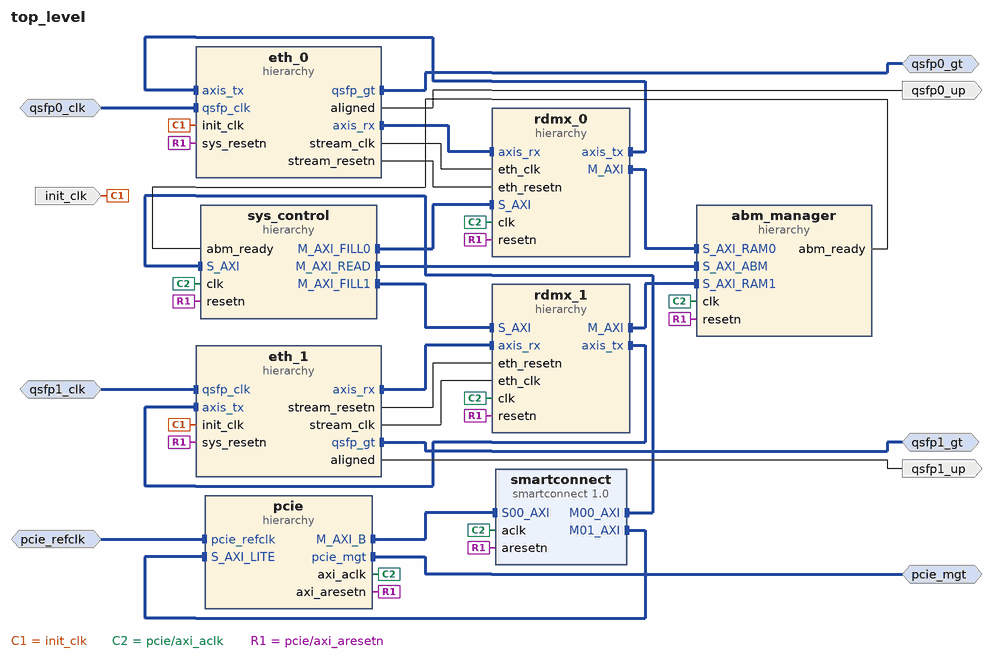
[diagram p0: block diagram of the top level]
# Vivado block design top_level, xcku15p-ffve1517-3-e, Vivado 2021.1
create_bd_design top_level

create_bd_intf_port -mode Slave -vlnv xilinx.com:interface:diff_clock_rtl:1.0 pcie_refclk
create_bd_intf_port -mode Master -vlnv xilinx.com:interface:pcie_7x_mgt_rtl:1.0 pcie_mgt
create_bd_intf_port -mode Slave -vlnv xilinx.com:interface:diff_clock_rtl:1.0 qsfp0_clk
set_property -dict {CONFIG.FREQ_HZ 322265625} [get_bd_intf_ports qsfp0_clk]
create_bd_intf_port -mode Master -vlnv xilinx.com:interface:gt_rtl:1.0 qsfp0_gt
create_bd_intf_port -mode Master -vlnv xilinx.com:interface:gt_rtl:1.0 qsfp1_gt
create_bd_intf_port -mode Slave -vlnv xilinx.com:interface:diff_clock_rtl:1.0 qsfp1_clk
set_property -dict {CONFIG.FREQ_HZ 322265625} [get_bd_intf_ports qsfp1_clk]
create_bd_port -dir O qsfp1_up
create_bd_port -dir O qsfp0_up
create_bd_port -dir I init_clk

create_bd_cell -type hier pcie
create_bd_cell -type hier eth_0
create_bd_cell -type ip -vlnv xilinx.com:ip:smartconnect:1.0 smartconnect
set_property -dict {CONFIG.NUM_CLKS 1 CONFIG.NUM_MI 2 CONFIG.NUM_SI 2} [get_bd_cells smartconnect]
create_bd_cell -type hier eth_1
create_bd_cell -type hier abm_manager
create_bd_cell -type hier sys_control
create_bd_cell -type hier rdmx_0
create_bd_cell -type hier rdmx_1

# ---- hierarchy /pcie ----
current_bd_instance /pcie
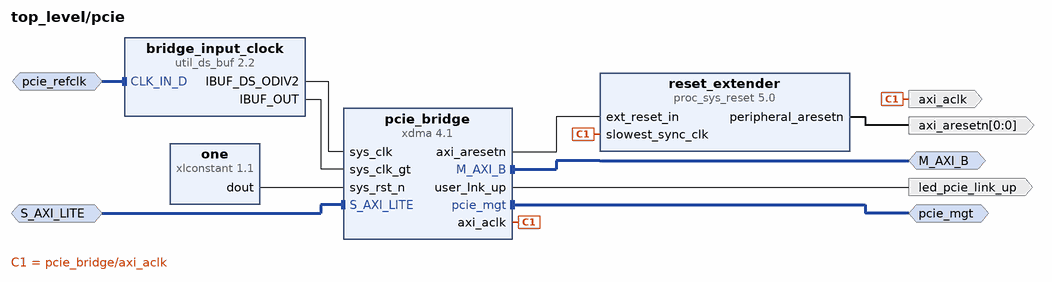
[diagram p1: block diagram inside /pcie]
create_bd_intf_pin -mode Master -vlnv xilinx.com:interface:aximm_rtl:1.0 M_AXI_B
create_bd_intf_pin -mode Slave -vlnv xilinx.com:interface:aximm_rtl:1.0 S_AXI_LITE
create_bd_intf_pin -mode Master -vlnv xilinx.com:interface:pcie_7x_mgt_rtl:1.0 pcie_mgt
create_bd_intf_pin -mode Slave -vlnv xilinx.com:interface:diff_clock_rtl:1.0 pcie_refclk
create_bd_pin -dir O led_pcie_link_up
create_bd_pin -dir O -type clk axi_aclk
create_bd_pin -dir O -from 0 -to 0 -type rst axi_aresetn

create_bd_cell -type ip -vlnv xilinx.com:ip:util_ds_buf:2.2 bridge_input_clock
set_property -dict {CONFIG.C_BUF_TYPE IBUFDSGTE} [get_bd_cells bridge_input_clock]
create_bd_cell -type ip -vlnv xilinx.com:ip:xdma:4.1 pcie_bridge
set_property -dict [list \
  CONFIG.PF0_DEVICE_ID_mqdma 903F \
  CONFIG.PF0_SRIOV_VF_DEVICE_ID A03F \
  CONFIG.PF2_DEVICE_ID_mqdma 923F \
  CONFIG.PF3_DEVICE_ID_mqdma 933F \
  CONFIG.axi_addr_width 64 \
  CONFIG.axi_data_width 512_bit \
  CONFIG.axisten_freq 250 \
  CONFIG.bridge_burst true \
  CONFIG.dma_reset_source_sel User_Reset \
  CONFIG.en_axi_slave_if false \
  CONFIG.enable_jtag_dbg false \
  CONFIG.functional_mode AXI_Bridge \
  CONFIG.mode_selection Advanced \
  CONFIG.pcie_blk_locn X0Y3 \
  CONFIG.pf0_bar0_scale Megabytes \
  CONFIG.pf0_bar0_size 1 \
  CONFIG.pf0_device_id 903F \
  CONFIG.pl_link_cap_max_link_speed 8.0_GT/s \
  CONFIG.pl_link_cap_max_link_width X16 \
  CONFIG.plltype QPLL1 \
] [get_bd_cells pcie_bridge]
create_bd_cell -type ip -vlnv xilinx.com:ip:xlconstant:1.1 one
create_bd_cell -type ip -vlnv xilinx.com:ip:proc_sys_reset:5.0 reset_extender

# ---- hierarchy /eth_0 ----
current_bd_instance /eth_0
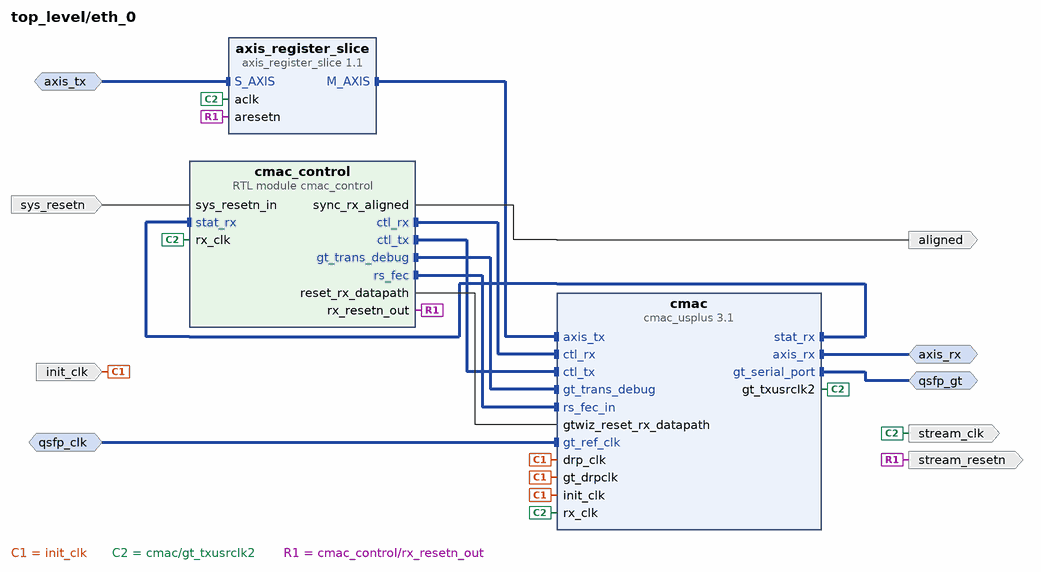
[diagram p2: block diagram inside /eth_0]
create_bd_intf_pin -mode Master -vlnv xilinx.com:interface:gt_rtl:1.0 qsfp_gt
create_bd_intf_pin -mode Slave -vlnv xilinx.com:interface:diff_clock_rtl:1.0 qsfp_clk
create_bd_intf_pin -mode Slave -vlnv xilinx.com:interface:axis_rtl:1.0 axis_tx
create_bd_intf_pin -mode Master -vlnv xilinx.com:interface:axis_rtl:1.0 axis_rx
create_bd_pin -dir I -type rst sys_resetn
create_bd_pin -dir O -type clk stream_clk
create_bd_pin -dir O -type rst stream_resetn
create_bd_pin -dir O aligned
create_bd_pin -dir I init_clk

create_bd_cell -type ip -vlnv xilinx.com:ip:cmac_usplus:3.1 cmac
set_property -dict [list \
  CONFIG.ADD_GT_CNRL_STS_PORTS 1 \
  CONFIG.CMAC_CAUI4_MODE 1 \
  CONFIG.CMAC_CORE_SELECT CMACE4_X0Y0 \
  CONFIG.GT_DRP_CLK 200 \
  CONFIG.GT_GROUP_SELECT {X0Y0~X0Y3} \
  CONFIG.GT_REF_CLK_FREQ 322.265625 \
  CONFIG.INCLUDE_RS_FEC 1 \
  CONFIG.NUM_LANES 4x25 \
  CONFIG.RX_FLOW_CONTROL 0 \
  CONFIG.TX_FLOW_CONTROL 0 \
  CONFIG.USER_INTERFACE AXIS \
] [get_bd_cells cmac]
create_bd_cell -type ip -vlnv xilinx.com:ip:axis_register_slice:1.1 axis_register_slice
create_bd_cell -type module -reference cmac_control cmac_control
set_property -dict {CONFIG.TX_PRECURSOR {"10100"}} [get_bd_cells cmac_control]

# ---- hierarchy /eth_1 ----
current_bd_instance /eth_1
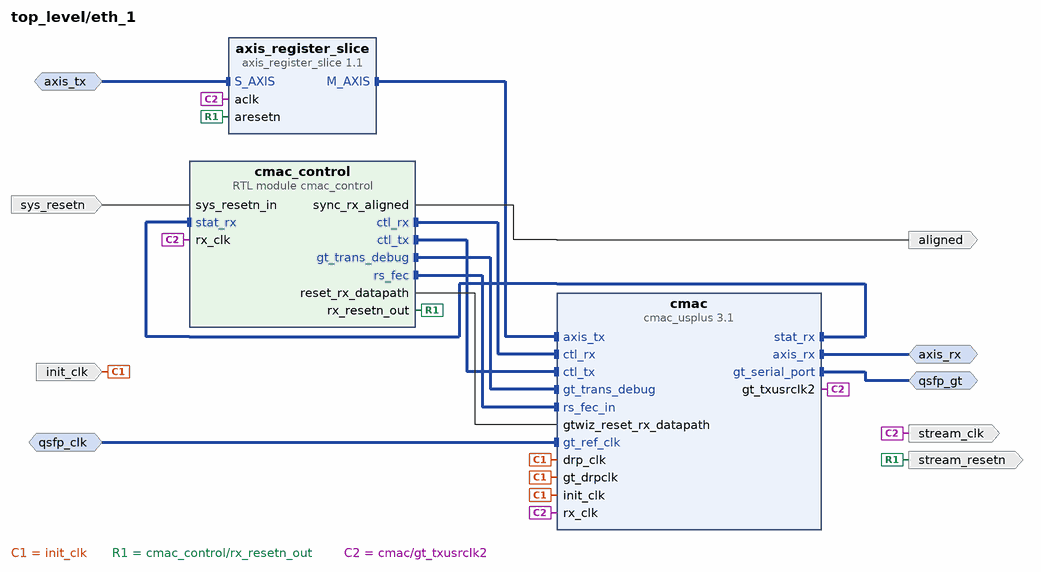
[diagram p3: block diagram inside /eth_1]
create_bd_intf_pin -mode Master -vlnv xilinx.com:interface:gt_rtl:1.0 qsfp_gt
create_bd_intf_pin -mode Slave -vlnv xilinx.com:interface:diff_clock_rtl:1.0 qsfp_clk
create_bd_intf_pin -mode Slave -vlnv xilinx.com:interface:axis_rtl:1.0 axis_tx
create_bd_intf_pin -mode Master -vlnv xilinx.com:interface:axis_rtl:1.0 axis_rx
create_bd_pin -dir I -type rst sys_resetn
create_bd_pin -dir O -type clk stream_clk
create_bd_pin -dir O aligned
create_bd_pin -dir I init_clk
create_bd_pin -dir O stream_resetn

create_bd_cell -type ip -vlnv xilinx.com:ip:cmac_usplus:3.1 cmac
set_property -dict [list \
  CONFIG.ADD_GT_CNRL_STS_PORTS 1 \
  CONFIG.CMAC_CAUI4_MODE 1 \
  CONFIG.CMAC_CORE_SELECT CMACE4_X0Y1 \
  CONFIG.GT_DRP_CLK 200 \
  CONFIG.GT_GROUP_SELECT {X0Y4~X0Y7} \
  CONFIG.GT_REF_CLK_FREQ 322.265625 \
  CONFIG.INCLUDE_RS_FEC 1 \
  CONFIG.NUM_LANES 4x25 \
  CONFIG.RX_FLOW_CONTROL 0 \
  CONFIG.TX_FLOW_CONTROL 0 \
  CONFIG.USER_INTERFACE AXIS \
] [get_bd_cells cmac]
create_bd_cell -type ip -vlnv xilinx.com:ip:axis_register_slice:1.1 axis_register_slice
create_bd_cell -type module -reference cmac_control cmac_control
set_property -dict {CONFIG.TX_PRECURSOR {"10100"}} [get_bd_cells cmac_control]

# ---- hierarchy /abm_manager ----
current_bd_instance /abm_manager
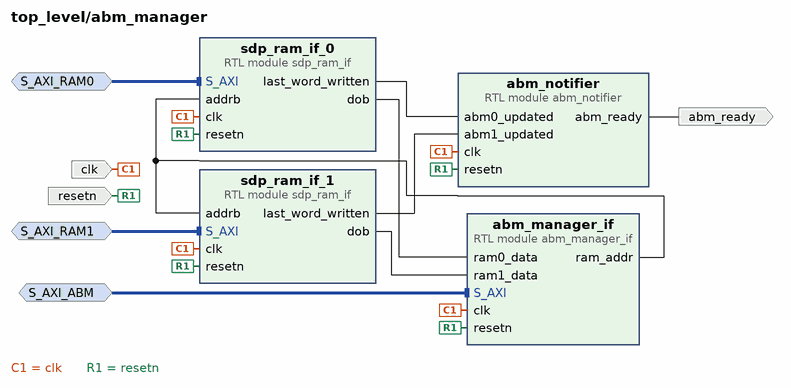
[diagram p4: block diagram inside /abm_manager]
create_bd_intf_pin -mode Slave -vlnv xilinx.com:interface:aximm_rtl:1.0 S_AXI_RAM0
create_bd_intf_pin -mode Slave -vlnv xilinx.com:interface:aximm_rtl:1.0 S_AXI_ABM
create_bd_intf_pin -mode Slave -vlnv xilinx.com:interface:aximm_rtl:1.0 S_AXI_RAM1
create_bd_pin -dir I -type clk clk
create_bd_pin -dir I -type rst resetn
create_bd_pin -dir O abm_ready

create_bd_cell -type module -reference abm_manager_if abm_manager_if
create_bd_cell -type module -reference abm_notifier abm_notifier
create_bd_cell -type module -reference sdp_ram_if sdp_ram_if_0
create_bd_cell -type module -reference sdp_ram_if sdp_ram_if_1

# ---- hierarchy /sys_control ----
current_bd_instance /sys_control
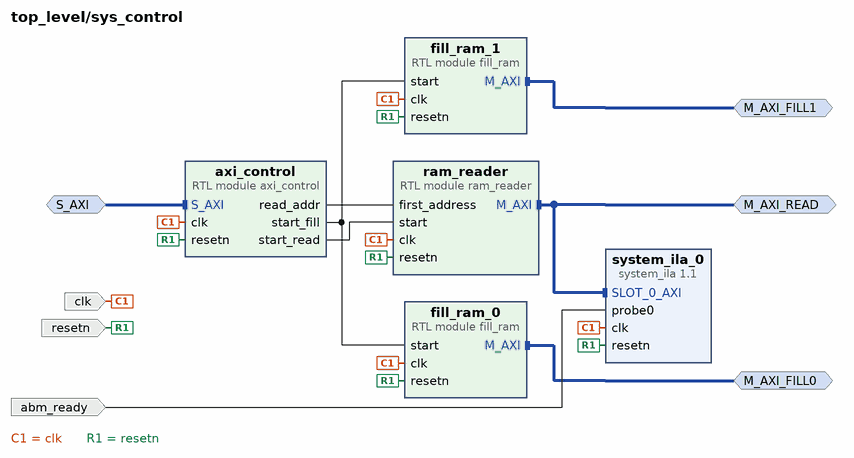
[diagram p5: block diagram inside /sys_control]
create_bd_intf_pin -mode Slave -vlnv xilinx.com:interface:aximm_rtl:1.0 S_AXI
create_bd_intf_pin -mode Master -vlnv xilinx.com:interface:aximm_rtl:1.0 M_AXI_READ
create_bd_intf_pin -mode Master -vlnv xilinx.com:interface:aximm_rtl:1.0 M_AXI_FILL0
create_bd_intf_pin -mode Master -vlnv xilinx.com:interface:aximm_rtl:1.0 M_AXI_FILL1
create_bd_pin -dir I -type clk clk
create_bd_pin -dir I -type rst resetn
create_bd_pin -dir I abm_ready

create_bd_cell -type module -reference axi_control axi_control
create_bd_cell -type ip -vlnv xilinx.com:ip:system_ila:1.1 system_ila_0
set_property -dict {CONFIG.C_MON_TYPE MIX} [get_bd_cells system_ila_0]
create_bd_cell -type module -reference ram_reader ram_reader
create_bd_cell -type module -reference fill_ram fill_ram_0
create_bd_cell -type module -reference fill_ram fill_ram_1
set_property -dict {CONFIG.FIRST_DATA 0x30000000} [get_bd_cells fill_ram_1]

# ---- hierarchy /rdmx_0 ----
current_bd_instance /rdmx_0
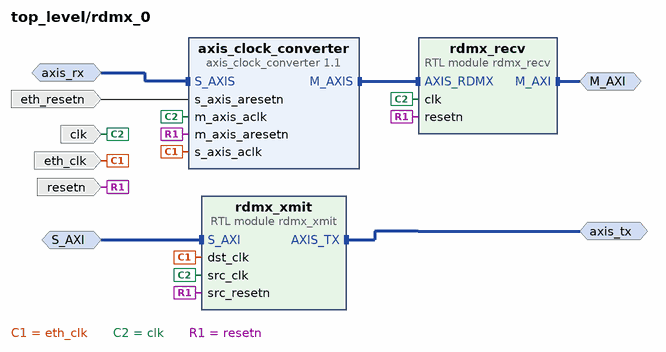
[diagram p6: block diagram inside /rdmx_0]
create_bd_intf_pin -mode Slave -vlnv xilinx.com:interface:axis_rtl:1.0 axis_rx
create_bd_intf_pin -mode Master -vlnv xilinx.com:interface:aximm_rtl:1.0 M_AXI
create_bd_intf_pin -mode Slave -vlnv xilinx.com:interface:aximm_rtl:1.0 S_AXI
create_bd_intf_pin -mode Master -vlnv xilinx.com:interface:axis_rtl:1.0 axis_tx
create_bd_pin -dir I -type rst eth_resetn
create_bd_pin -dir I -type rst resetn
create_bd_pin -dir I -type clk eth_clk
create_bd_pin -dir I -type clk clk

create_bd_cell -type module -reference rdmx_xmit rdmx_xmit
create_bd_cell -type ip -vlnv xilinx.com:ip:axis_clock_converter:1.1 axis_clock_converter
create_bd_cell -type module -reference rdmx_recv rdmx_recv

# ---- hierarchy /rdmx_1 ----
current_bd_instance /rdmx_1
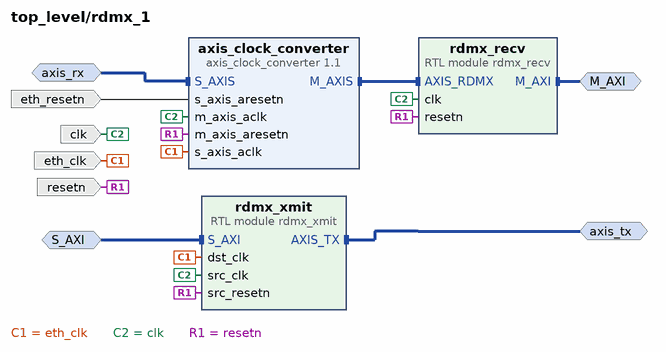
[diagram p7: block diagram inside /rdmx_1]
create_bd_intf_pin -mode Slave -vlnv xilinx.com:interface:axis_rtl:1.0 axis_rx
create_bd_intf_pin -mode Master -vlnv xilinx.com:interface:aximm_rtl:1.0 M_AXI
create_bd_intf_pin -mode Slave -vlnv xilinx.com:interface:aximm_rtl:1.0 S_AXI
create_bd_intf_pin -mode Master -vlnv xilinx.com:interface:axis_rtl:1.0 axis_tx
create_bd_pin -dir I -type rst eth_resetn
create_bd_pin -dir I -type rst resetn
create_bd_pin -dir I -type clk eth_clk
create_bd_pin -dir I -type clk clk

create_bd_cell -type module -reference rdmx_xmit rdmx_xmit
create_bd_cell -type ip -vlnv xilinx.com:ip:axis_clock_converter:1.1 axis_clock_converter
create_bd_cell -type module -reference rdmx_recv rdmx_recv

# ---- connections ----

current_bd_instance /pcie
connect_bd_intf_net [get_bd_intf_pins pcie_refclk] [get_bd_intf_pins bridge_input_clock/CLK_IN_D]
connect_bd_intf_net [get_bd_intf_pins S_AXI_LITE] [get_bd_intf_pins pcie_bridge/S_AXI_LITE]
connect_bd_intf_net [get_bd_intf_pins M_AXI_B] [get_bd_intf_pins pcie_bridge/M_AXI_B]
connect_bd_intf_net [get_bd_intf_pins pcie_mgt] [get_bd_intf_pins pcie_bridge/pcie_mgt]
connect_bd_net [get_bd_pins bridge_input_clock/IBUF_DS_ODIV2] [get_bd_pins pcie_bridge/sys_clk]
connect_bd_net [get_bd_pins bridge_input_clock/IBUF_OUT] [get_bd_pins pcie_bridge/sys_clk_gt]
connect_bd_net [get_bd_pins one/dout] [get_bd_pins pcie_bridge/sys_rst_n]
connect_bd_net [get_bd_pins pcie_bridge/axi_aresetn] [get_bd_pins reset_extender/ext_reset_in]
connect_bd_net -net proc_sys_reset_0_peripheral_aresetn [get_bd_pins reset_extender/peripheral_aresetn] [get_bd_pins axi_aresetn]
connect_bd_net -net xdma_0_axi_aclk [get_bd_pins pcie_bridge/axi_aclk] [get_bd_pins axi_aclk] [get_bd_pins reset_extender/slowest_sync_clk]
connect_bd_net -net xdma_0_user_lnk_up [get_bd_pins pcie_bridge/user_lnk_up] [get_bd_pins led_pcie_link_up]

current_bd_instance /eth_0
connect_bd_intf_net [get_bd_intf_pins axis_rx] [get_bd_intf_pins cmac/axis_rx]
connect_bd_intf_net [get_bd_intf_pins axis_register_slice/M_AXIS] [get_bd_intf_pins cmac/axis_tx]
connect_bd_intf_net [get_bd_intf_pins axis_tx] [get_bd_intf_pins axis_register_slice/S_AXIS]
connect_bd_intf_net [get_bd_intf_pins cmac_control/ctl_rx] [get_bd_intf_pins cmac/ctl_rx]
connect_bd_intf_net [get_bd_intf_pins cmac_control/ctl_tx] [get_bd_intf_pins cmac/ctl_tx]
connect_bd_intf_net [get_bd_intf_pins cmac_control/gt_trans_debug] [get_bd_intf_pins cmac/gt_trans_debug]
connect_bd_intf_net [get_bd_intf_pins cmac_control/rs_fec] [get_bd_intf_pins cmac/rs_fec_in]
connect_bd_intf_net [get_bd_intf_pins cmac_control/stat_rx] [get_bd_intf_pins cmac/stat_rx]
connect_bd_intf_net [get_bd_intf_pins qsfp_gt] [get_bd_intf_pins cmac/gt_serial_port]
connect_bd_intf_net [get_bd_intf_pins qsfp_clk] [get_bd_intf_pins cmac/gt_ref_clk]
connect_bd_net -net clk_0_1 [get_bd_pins init_clk] [get_bd_pins cmac/init_clk] [get_bd_pins cmac/drp_clk] [get_bd_pins cmac/gt_drpclk]
connect_bd_net [get_bd_pins cmac_control/reset_rx_datapath] [get_bd_pins cmac/gtwiz_reset_rx_datapath]
connect_bd_net [get_bd_pins cmac_control/sync_rx_aligned] [get_bd_pins aligned]
connect_bd_net -net cmac_gt_rxusrclk2 [get_bd_pins cmac/gt_txusrclk2] \
  [get_bd_pins cmac/rx_clk] [get_bd_pins stream_clk] [get_bd_pins axis_register_slice/aclk] [get_bd_pins cmac_control/rx_clk]
connect_bd_net -net cmac_reset_mgr_0_stream_resetn [get_bd_pins cmac_control/rx_resetn_out] \
  [get_bd_pins stream_resetn] [get_bd_pins axis_register_slice/aresetn]
connect_bd_net [get_bd_pins sys_resetn] [get_bd_pins cmac_control/sys_resetn_in]

current_bd_instance /eth_1
connect_bd_intf_net [get_bd_intf_pins axis_rx] [get_bd_intf_pins cmac/axis_rx]
connect_bd_intf_net [get_bd_intf_pins axis_register_slice/M_AXIS] [get_bd_intf_pins cmac/axis_tx]
connect_bd_intf_net [get_bd_intf_pins axis_tx] [get_bd_intf_pins axis_register_slice/S_AXIS]
connect_bd_intf_net [get_bd_intf_pins cmac_control/ctl_rx] [get_bd_intf_pins cmac/ctl_rx]
connect_bd_intf_net [get_bd_intf_pins cmac_control/ctl_tx] [get_bd_intf_pins cmac/ctl_tx]
connect_bd_intf_net [get_bd_intf_pins cmac_control/gt_trans_debug] [get_bd_intf_pins cmac/gt_trans_debug]
connect_bd_intf_net [get_bd_intf_pins cmac_control/rs_fec] [get_bd_intf_pins cmac/rs_fec_in]
connect_bd_intf_net [get_bd_intf_pins cmac_control/stat_rx] [get_bd_intf_pins cmac/stat_rx]
connect_bd_intf_net [get_bd_intf_pins qsfp_gt] [get_bd_intf_pins cmac/gt_serial_port]
connect_bd_intf_net [get_bd_intf_pins qsfp_clk] [get_bd_intf_pins cmac/gt_ref_clk]
connect_bd_net -net clk_0_1 [get_bd_pins init_clk] [get_bd_pins cmac/init_clk] [get_bd_pins cmac/drp_clk] [get_bd_pins cmac/gt_drpclk]
connect_bd_net [get_bd_pins cmac_control/reset_rx_datapath] [get_bd_pins cmac/gtwiz_reset_rx_datapath]
connect_bd_net [get_bd_pins cmac_control/rx_resetn_out] [get_bd_pins axis_register_slice/aresetn] [get_bd_pins stream_resetn]
connect_bd_net [get_bd_pins cmac_control/sync_rx_aligned] [get_bd_pins aligned]
connect_bd_net -net cmac_gt_rxusrclk2 [get_bd_pins cmac/gt_txusrclk2] \
  [get_bd_pins cmac/rx_clk] [get_bd_pins stream_clk] [get_bd_pins axis_register_slice/aclk] [get_bd_pins cmac_control/rx_clk]
connect_bd_net [get_bd_pins sys_resetn] [get_bd_pins cmac_control/sys_resetn_in]

current_bd_instance /abm_manager
connect_bd_intf_net [get_bd_intf_pins S_AXI_ABM] [get_bd_intf_pins abm_manager_if/S_AXI]
connect_bd_intf_net [get_bd_intf_pins S_AXI_RAM0] [get_bd_intf_pins sdp_ram_if_0/S_AXI]
connect_bd_intf_net [get_bd_intf_pins S_AXI_RAM1] [get_bd_intf_pins sdp_ram_if_1/S_AXI]
connect_bd_net [get_bd_pins abm_manager_if/ram_addr] [get_bd_pins sdp_ram_if_0/addrb] [get_bd_pins sdp_ram_if_1/addrb]
connect_bd_net [get_bd_pins abm_notifier/abm_ready] [get_bd_pins abm_ready]
connect_bd_net [get_bd_pins sdp_ram_if_0/dob] [get_bd_pins abm_manager_if/ram0_data]
connect_bd_net [get_bd_pins sdp_ram_if_0/last_word_written] [get_bd_pins abm_notifier/abm0_updated]
connect_bd_net [get_bd_pins sdp_ram_if_1/dob] [get_bd_pins abm_manager_if/ram1_data]
connect_bd_net [get_bd_pins sdp_ram_if_1/last_word_written] [get_bd_pins abm_notifier/abm1_updated]
connect_bd_net -net source_200Mhz_clk [get_bd_pins clk] \
  [get_bd_pins abm_manager_if/clk] [get_bd_pins abm_notifier/clk] [get_bd_pins sdp_ram_if_0/clk] \
  [get_bd_pins sdp_ram_if_1/clk]
connect_bd_net -net source_200Mhz_resetn [get_bd_pins resetn] \
  [get_bd_pins abm_manager_if/resetn] [get_bd_pins abm_notifier/resetn] [get_bd_pins sdp_ram_if_0/resetn] \
  [get_bd_pins sdp_ram_if_1/resetn]

current_bd_instance /sys_control
connect_bd_intf_net [get_bd_intf_pins M_AXI_FILL0] [get_bd_intf_pins fill_ram_0/M_AXI]
connect_bd_intf_net [get_bd_intf_pins M_AXI_FILL1] [get_bd_intf_pins fill_ram_1/M_AXI]
connect_bd_intf_net [get_bd_intf_pins M_AXI_READ] [get_bd_intf_pins ram_reader/M_AXI]
connect_bd_intf_net [get_bd_intf_pins M_AXI_READ] [get_bd_intf_pins system_ila_0/SLOT_0_AXI]
connect_bd_intf_net [get_bd_intf_pins S_AXI] [get_bd_intf_pins axi_control/S_AXI]
connect_bd_net [get_bd_pins abm_ready] [get_bd_pins system_ila_0/probe0]
connect_bd_net [get_bd_pins axi_control/read_addr] [get_bd_pins ram_reader/first_address]
connect_bd_net [get_bd_pins axi_control/start_fill] [get_bd_pins fill_ram_0/start] [get_bd_pins fill_ram_1/start]
connect_bd_net [get_bd_pins axi_control/start_read] [get_bd_pins ram_reader/start]
connect_bd_net -net source_200Mhz_clk [get_bd_pins clk] \
  [get_bd_pins axi_control/clk] [get_bd_pins system_ila_0/clk] [get_bd_pins ram_reader/clk] [get_bd_pins fill_ram_0/clk] \
  [get_bd_pins fill_ram_1/clk]
connect_bd_net -net source_200Mhz_resetn [get_bd_pins resetn] \
  [get_bd_pins axi_control/resetn] [get_bd_pins system_ila_0/resetn] [get_bd_pins ram_reader/resetn] \
  [get_bd_pins fill_ram_0/resetn] [get_bd_pins fill_ram_1/resetn]

current_bd_instance /rdmx_0
connect_bd_intf_net [get_bd_intf_pins S_AXI] [get_bd_intf_pins rdmx_xmit/S_AXI]
connect_bd_intf_net [get_bd_intf_pins axis_tx] [get_bd_intf_pins rdmx_xmit/AXIS_TX]
connect_bd_intf_net [get_bd_intf_pins axis_clock_converter/M_AXIS] [get_bd_intf_pins rdmx_recv/AXIS_RDMX]
connect_bd_intf_net [get_bd_intf_pins axis_rx] [get_bd_intf_pins axis_clock_converter/S_AXIS]
connect_bd_intf_net [get_bd_intf_pins M_AXI] [get_bd_intf_pins rdmx_recv/M_AXI]
connect_bd_net -net eth0_resetn_1 [get_bd_pins eth_resetn] [get_bd_pins axis_clock_converter/s_axis_aresetn]
connect_bd_net -net eth_0_stream_clk [get_bd_pins eth_clk] [get_bd_pins rdmx_xmit/dst_clk] [get_bd_pins axis_clock_converter/s_axis_aclk]
connect_bd_net -net source_200Mhz_clk [get_bd_pins clk] \
  [get_bd_pins rdmx_xmit/src_clk] [get_bd_pins axis_clock_converter/m_axis_aclk] [get_bd_pins rdmx_recv/clk]
connect_bd_net -net source_200Mhz_resetn [get_bd_pins resetn] \
  [get_bd_pins rdmx_xmit/src_resetn] [get_bd_pins axis_clock_converter/m_axis_aresetn] [get_bd_pins rdmx_recv/resetn]

current_bd_instance /rdmx_1
connect_bd_intf_net [get_bd_intf_pins S_AXI] [get_bd_intf_pins rdmx_xmit/S_AXI]
connect_bd_intf_net [get_bd_intf_pins axis_tx] [get_bd_intf_pins rdmx_xmit/AXIS_TX]
connect_bd_intf_net [get_bd_intf_pins axis_clock_converter/M_AXIS] [get_bd_intf_pins rdmx_recv/AXIS_RDMX]
connect_bd_intf_net [get_bd_intf_pins axis_rx] [get_bd_intf_pins axis_clock_converter/S_AXIS]
connect_bd_intf_net [get_bd_intf_pins M_AXI] [get_bd_intf_pins rdmx_recv/M_AXI]
connect_bd_net -net eth0_resetn_1 [get_bd_pins eth_resetn] [get_bd_pins axis_clock_converter/s_axis_aresetn]
connect_bd_net -net eth_0_stream_clk [get_bd_pins eth_clk] [get_bd_pins rdmx_xmit/dst_clk] [get_bd_pins axis_clock_converter/s_axis_aclk]
connect_bd_net -net source_200Mhz_clk [get_bd_pins clk] \
  [get_bd_pins rdmx_xmit/src_clk] [get_bd_pins axis_clock_converter/m_axis_aclk] [get_bd_pins rdmx_recv/clk]
connect_bd_net -net source_200Mhz_resetn [get_bd_pins resetn] \
  [get_bd_pins rdmx_xmit/src_resetn] [get_bd_pins axis_clock_converter/m_axis_aresetn] [get_bd_pins rdmx_recv/resetn]

current_bd_instance /
connect_bd_intf_net [get_bd_intf_pins rdmx_1/S_AXI] [get_bd_intf_pins sys_control/M_AXI_FILL1]
connect_bd_intf_net [get_bd_intf_pins rdmx_1/axis_rx] [get_bd_intf_pins eth_1/axis_rx]
connect_bd_intf_net [get_bd_intf_pins eth_0/axis_tx] [get_bd_intf_pins rdmx_0/axis_tx]
connect_bd_intf_net [get_bd_intf_ports qsfp0_gt] [get_bd_intf_pins eth_0/qsfp_gt]
connect_bd_intf_net [get_bd_intf_pins rdmx_0/axis_rx] [get_bd_intf_pins eth_0/axis_rx]
connect_bd_intf_net [get_bd_intf_ports qsfp1_gt] [get_bd_intf_pins eth_1/qsfp_gt]
connect_bd_intf_net [get_bd_intf_ports qsfp0_clk] [get_bd_intf_pins eth_0/qsfp_clk]
connect_bd_intf_net [get_bd_intf_ports pcie_refclk] [get_bd_intf_pins pcie/pcie_refclk]
connect_bd_intf_net [get_bd_intf_ports qsfp1_clk] [get_bd_intf_pins eth_1/qsfp_clk]
connect_bd_intf_net [get_bd_intf_pins sys_control/M_AXI_READ] [get_bd_intf_pins abm_manager/S_AXI_ABM]
connect_bd_intf_net [get_bd_intf_pins rdmx_1/M_AXI] [get_bd_intf_pins abm_manager/S_AXI_RAM1]
connect_bd_intf_net [get_bd_intf_pins rdmx_1/axis_tx] [get_bd_intf_pins eth_1/axis_tx]
connect_bd_intf_net [get_bd_intf_pins rdmx_0/M_AXI] [get_bd_intf_pins abm_manager/S_AXI_RAM0]
connect_bd_intf_net [get_bd_intf_pins pcie/S_AXI_LITE] [get_bd_intf_pins smartconnect/M01_AXI]
connect_bd_intf_net [get_bd_intf_pins sys_control/S_AXI] [get_bd_intf_pins smartconnect/M00_AXI]
connect_bd_intf_net [get_bd_intf_pins sys_control/M_AXI_FILL0] [get_bd_intf_pins rdmx_0/S_AXI]
connect_bd_intf_net [get_bd_intf_pins pcie/M_AXI_B] [get_bd_intf_pins smartconnect/S00_AXI]
connect_bd_intf_net [get_bd_intf_ports pcie_mgt] [get_bd_intf_pins pcie/pcie_mgt]
connect_bd_net [get_bd_pins abm_manager/abm_ready] [get_bd_pins sys_control/abm_ready]
connect_bd_net -net eth_0_stat_rx_aligned_0 [get_bd_pins eth_0/aligned] [get_bd_ports qsfp0_up]
connect_bd_net [get_bd_pins eth_0/stream_clk] [get_bd_pins rdmx_0/eth_clk]
connect_bd_net [get_bd_pins eth_0/stream_resetn] [get_bd_pins rdmx_0/eth_resetn]
connect_bd_net -net eth_1_rx_aligned [get_bd_pins eth_1/aligned] [get_bd_ports qsfp1_up]
connect_bd_net [get_bd_pins eth_1/stream_resetn] [get_bd_pins rdmx_1/eth_resetn]
connect_bd_net -net eth_clk_1 [get_bd_pins eth_1/stream_clk] [get_bd_pins rdmx_1/eth_clk]
connect_bd_net -net init_clk_0_1 [get_bd_ports init_clk] [get_bd_pins eth_1/init_clk] [get_bd_pins eth_0/init_clk]
connect_bd_net -net source_200Mhz_clk [get_bd_pins pcie/axi_aclk] \
  [get_bd_pins smartconnect/aclk] [get_bd_pins abm_manager/clk] [get_bd_pins sys_control/clk] [get_bd_pins rdmx_0/clk] \
  [get_bd_pins rdmx_1/clk]
connect_bd_net -net source_200Mhz_resetn [get_bd_pins pcie/axi_aresetn] \
  [get_bd_pins smartconnect/aresetn] [get_bd_pins eth_0/sys_resetn] [get_bd_pins eth_1/sys_resetn] \
  [get_bd_pins abm_manager/resetn] [get_bd_pins sys_control/resetn] [get_bd_pins rdmx_0/resetn] [get_bd_pins rdmx_1/resetn]

# ---- address map ----
assign_bd_address -offset 0x0000000000001000 -range 256 -target_address_space [get_bd_addr_spaces pcie/pcie_bridge/M_AXI_B] [get_bd_addr_segs sys_control/axi_control/S_AXI/reg0]
assign_bd_address -offset 0x0000000000010000 -range 64K -target_address_space [get_bd_addr_spaces pcie/pcie_bridge/M_AXI_B] [get_bd_addr_segs pcie/pcie_bridge/S_AXI_LITE/CTL0]
assign_bd_address -offset 0x0000000000000000 -range 4G -target_address_space [get_bd_addr_spaces rdmx_0/rdmx_recv/M_AXI] [get_bd_addr_segs abm_manager/sdp_ram_if_0/S_AXI/reg0]
assign_bd_address -offset 0x0000000000000000 -range 4G -target_address_space [get_bd_addr_spaces rdmx_1/rdmx_recv/M_AXI] [get_bd_addr_segs abm_manager/sdp_ram_if_1/S_AXI/reg0]
assign_bd_address -offset 0x00000 -range 64K -target_address_space [get_bd_addr_spaces sys_control/fill_ram_0/M_AXI] [get_bd_addr_segs rdmx_0/rdmx_xmit/S_AXI/reg0]
assign_bd_address -offset 0x00000 -range 64K -target_address_space [get_bd_addr_spaces sys_control/fill_ram_1/M_AXI] [get_bd_addr_segs rdmx_1/rdmx_xmit/S_AXI/reg0]
assign_bd_address -offset 0x00000000 -range 64K -target_address_space [get_bd_addr_spaces sys_control/ram_reader/M_AXI] [get_bd_addr_segs abm_manager/abm_manager_if/S_AXI/reg0]

validate_bd_design
save_bd_design
